# Altium schematic sheet Peripherals.SchDoc
size A4; SheetNumber: 3; SheetTotal: 3
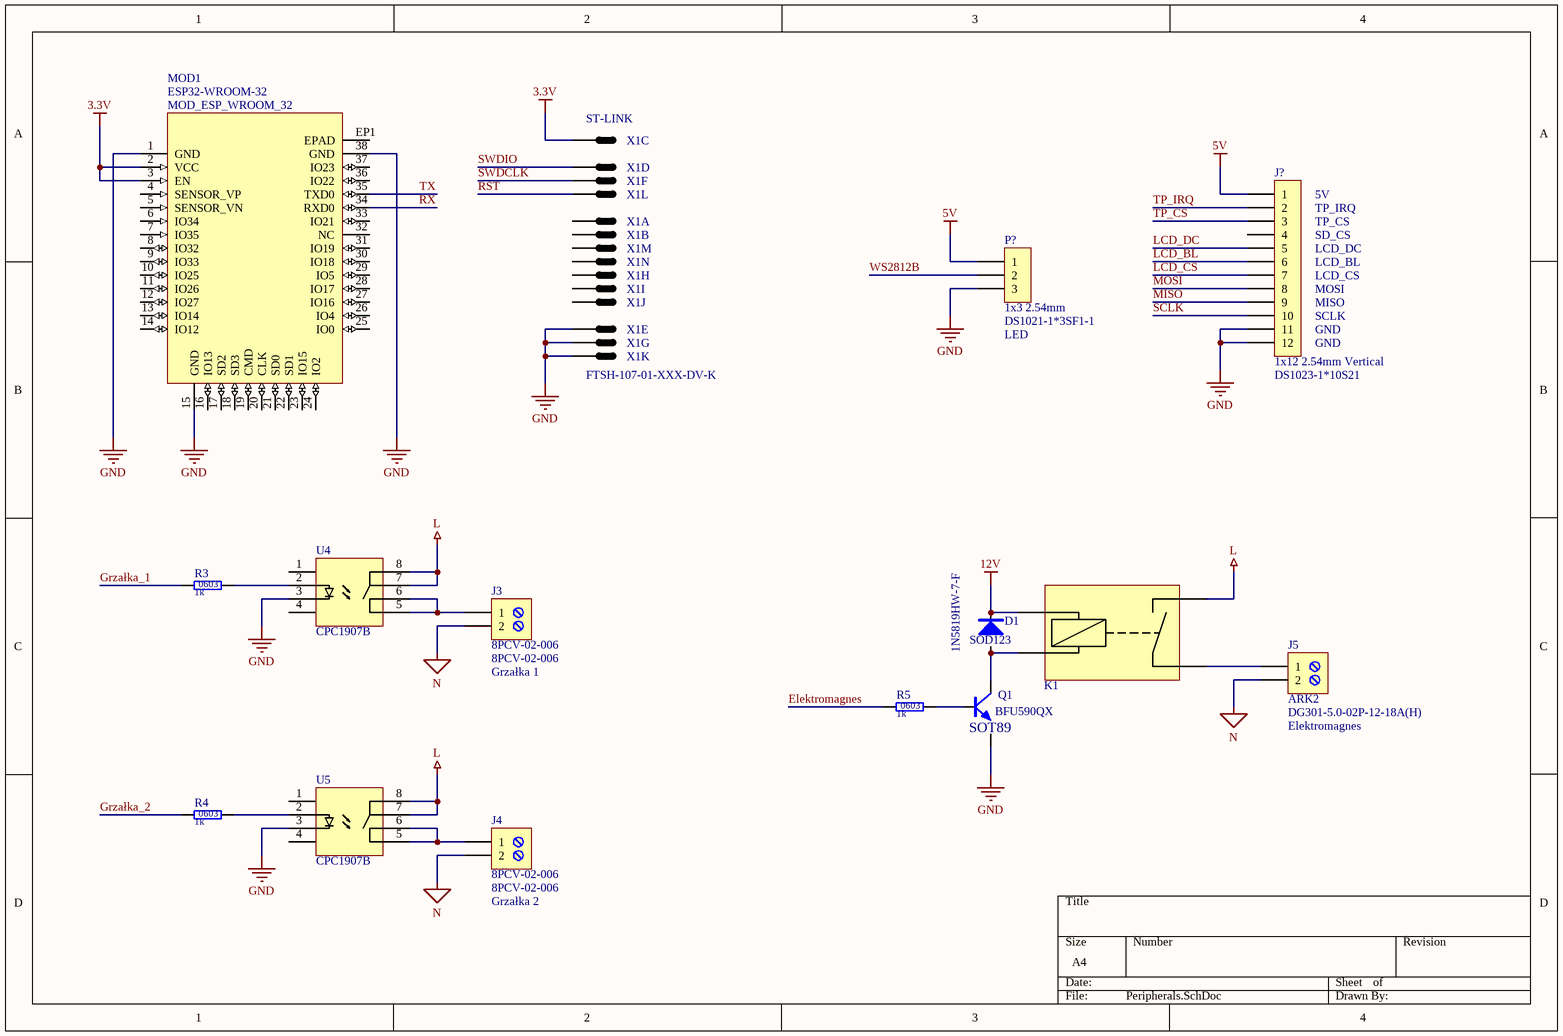
[diagram p0: Peripherals.SchDoc]

## Parts
D1  value 1N5819HW-7-F  [SOD123]  (hidden comment: 1N5819HW)
J3  value 8PCV-02-006  [J_8PCV-02-006]  (hidden comment: 600V 30A connector)
J4  value 8PCV-02-006  [J_8PCV-02-006]  (hidden comment: 600V 30A connector)
J5  value DG301-5.0-02P-12-18A(H)  [J_ARK2]  (hidden comment: ARK2)
J?  value DS1023-1*10S21  SCH_Footprint: 1x12 2.54mm Vertical  [J_HEADER_1x12_2.54_VERTICAL]  (hidden comment: Goldpin female straight)
K1  FTR-F3AA012E  [FTR-F3AA012E]  (value not drawn)
MOD1  value ESP32-WROOM-32  [MOD_ESP_WROOM_32]  (hidden comment: 2.4 GHz Wi-Fi-and-Bluetooth combo chip)
P?  value DS1021-1*3SF1-1  SCH_Footprint: 1x3 2.54mm  [P_HEADER_1x3_2.54]  (hidden comment: Goldpin)
Q1  SCH_Footprint: SOT89  [SOT89_TO-243AA_N]  (hidden comment: BFU590QX)
R3  value 1k  SCH_Footprint: 0603  [R_0603_1608]  (hidden comment: Resistor)
R4  value 1k  SCH_Footprint: 0603  [R_0603_1608]  (hidden comment: Resistor)
R5  value 1k  SCH_Footprint: 0603  [R_0603_1608]  (hidden comment: Resistor)
U4  CPC1907B  [CPC1907B]
U5  CPC1907B  [CPC1907B]
X1  FTSH-107-01-XXX-DV-K  [FTSH-107-01-XXX-DV-K]  (value not drawn)  (parts A,B,C,D,E,F,G,H,I,J,K,L,M,N of 14)

## Nets
3.3V: MOD1.2(VCC) MOD1.3(EN) X1.3
5V: J?.1 P?.1
12V: D1.1 K1.1
GND: J?.11 J?.12 MOD1.1(GND) MOD1.15(GND) MOD1.38(GND) P?.3 Q1.1(E) U4.3 U5.3 X1.5 X1.7 X1.11
L: K1.3 U4.7 U4.8 U5.7 U5.8
N: J3.2 J4.2 J5.2
Elektromagnes: R5.1
Grzałka_1: R3.1
Grzałka_2: R4.1
LCD_BL: J?.6
LCD_CS: J?.7
LCD_DC: J?.5
MISO: J?.9
MOSI: J?.8
RST: X1.12
RX: MOD1.34(RXD0)
SCLK: J?.10
SWDCLK: X1.6
SWDIO: X1.4
TP_CS: J?.3
TP_IRQ: J?.2
TX: MOD1.35(TXD0)
WS2812B: P?.2
NetD1_2: D1.2 K1.2 Q1.2(C)
NetJ3_1: J3.1 U4.5 U4.6
NetJ4_1: J4.1 U5.5 U5.6
NetJ5_1: J5.1 K1.4
NetQ1_3: Q1.3(B) R5.2
NetR3_2: R3.2 U4.2
NetR4_2: R4.2 U5.2

Not connected (* = marked no-connect by the designer): J? 4; MOD1 4(SENSOR_VP) 5(SENSOR_VN) 6(IO34) 7(IO35) 8(IO32) 9(IO33) 10(IO25) 11(IO26) 12(IO27) 13(IO14) 14(IO12) 16(IO13) 17(SD2) 18(SD3) 19(CMD) 20(CLK) 21(SD0) 22(SD1) 23(IO15) 24(IO2) 25(IO0) 26(IO4) 27(IO16) 28(IO17) 29(IO5) 30(IO18) 31(IO19) 32(NC) 33(IO21) 36(IO22) 37(IO23) EP1(EPAD); U4 1 4; U5 1 4; X1 1 2 8 9 10 13 14

## Notes on the sheet
- (near X1) ST-LINK
- (near J?) 5V
- (near J?) TP_IRQ
- (near J?) TP_CS
- (near J?) SD_CS
- (near J?) LCD_DC
- (near J?) LCD_BL
- (near J?) LCD_CS
- (near J?) MOSI
- (near J?) MISO
- (near J?) SCLK
- (near P?) LED
- (near J?) GND
- (near J3) Grzałka 1
- (near J5) Elektromagnes
- (near J4) Grzałka 2

## Library data of the parts
D1 = D_1N5819HW_1A_40V_SOD123: Manufacturer: Diodes Inc; Voltage: 40V; Current: 1A; SCH_Footprint: SOD123; Part Number: D_1N5819HW_1A_40V_SOD123; HelpURL: https://datasheet.octopart.com/1N5819HW-7-F-Diodes-Inc.-datasheet-8332965.pdf; Manufacturer Part Number: 1N5819HW-7-F; Supplier 1: TME; Supplier Part Number 1: 1N5819HW-7-F; Supplier 2: RS Components; Supplier Part Number 2: 7082197; Supplier 3: Farnell; Supplier Part Number 3: 1773475; Supplier 4: Mouser; Supplier Part Number 4: 621-1N5819HW-F; Supplier 5: Digi-Key; Supplier Part Number 5: 1N5819HW-FDICT-ND; Supplier 6: LCSC
J3 J4 = J_8PCV-02-006: ARK Screw terminal, 2-Pin; Manufacturer: TE Connectivity; SCH_Footprint: 8PCV-02-006; Part Number: J_8PCV-02-006; HelpURL: http://www.mouser.com/ds/2/418/NG_CD_6-1437657-3_K4-669783.pdf; Manufacturer Part Number: 8PCV-02-006; Supplier 1: TME; Supplier 2: RS Components; Supplier Part Number 2: 7176637; Supplier 3: Farnell; Supplier 4: Mouser; Supplier Part Number 4: 571-514376577; Supplier 5: Digi-Key; Supplier Part Number 5: A98460-ND; Supplier 6: LCSC
J5 = J_TB-5.0-P-2P: ARK Screw terminal, 2-Pin; Manufacturer: DEGSON ELECTRONICS; SCH_Footprint: ARK2; Part Number: J_TB-5.0-P-2P; HelpURL: https://datasheet.octopart.com/DG301-5.0-03P-12-18A%28H%29-Degson-datasheet-17801202.pdf; Manufacturer Part Number: DG301-5.0-02P-12-18A(H); Supplier 1: TME; Supplier Part Number 1: DG301-5.0-2/6B; Supplier 2: RS Components; Supplier 3: Farnell; Supplier 4: Mouser; Supplier 5: Digi-Key; Supplier 6: LCSC
J? = J_HEADER_1x12_2.54_VERTICAL: Pin Header; Manufacturer: Connfly; Part Number: J_HEADER_1x12_2.54_VERTICAL; HelpURL: https://www.tme.eu/Document/efd0203e2d3a140765df98191085ea88/DS1023.pdf; Manufacturer Part Number: DS1023-1*10S21; Supplier 1: TME; Supplier Part Number 1: ZL262-10SG; Supplier 2: RS Components; Supplier 3: Farnell; Supplier 4: Mouser; Supplier 5: Digi-Key; Supplier 6: LCSC
MOD1 = MOD_ESP32-WROOM-32: Manufacturer: ESPRESSIF; SCH_Footprint: MOD_ESP_WROOM_32; Part Number: MOD_ESP32-WROOM-32; HelpURL: https://www.espressif.com/sites/default/files/documentation/esp32-wroom-32d_esp32-wroom-32u_datasheet_en.pdf; Manufacturer Part Number: ESP32-WROOM-32; Supplier 1: TME; Supplier Part Number 1: ESP32-WROOM-32; Supplier 2: RS Components; Supplier Part Number 2: 169-7594; Supplier 3: Farnell; Supplier 4: Mouser; Supplier Part Number 4: 356-ESP-WROOM-32; Supplier 5: Digi-Key; Supplier Part Number 5: 1904-1010-1-ND; Supplier 6: LCSC
P? = P_HEADER_1x3_2.54: Pin Header; Manufacturer: Connfly; Part Number: P_HEADER_1x3_2.54; HelpURL: http://www.tme.eu/en/Document/cc301e58a5da78cb543a94b5a5b7f06a/DS1021.pdf; Manufacturer Part Number: DS1021-1*3SF1-1; Supplier 1: TME; Supplier Part Number 1: ZL201-03G; Supplier 2: RS Components; Supplier 3: Farnell; Supplier 4: Mouser; Supplier 5: Digi-Key; Supplier 6: LCSC
Q1 = QNP_BFU590QX: Manufacturer: NXP; Type: NPN; Voltage: 12V; Current: 200mA; Part Number: QNP_BFU590QX; Value: BFU590QX; HelpURL: https://www.nxp.com/docs/en/data-sheet/BFU590Q.pdf; Manufacturer Part Number: BFU590QX; Supplier 1: TME; Supplier 2: RS Components; Supplier 3: Farnell; Supplier Part Number 3: 2776273; Supplier 4: Mouser; Supplier Part Number 4: 771-BFU590QX; Supplier 5: Digi-Key; Supplier Part Number 5: 568-11522-1-ND; Supplier 6: LCSC
R3-R5 = R_1k_0603_1: Manufacturer: Vishay; Manufacturer Part Number: CRCW06031K00FKEA; Voltage: 75V; Power: 100mW; Tolerance: 1%; Part Number: R_1k_0603_1; HelpURL: http://www.farnell.com/datasheets/2310790.pdf?_ga=2.256888843.1690599162.1548417389-1379097396.1542296996&_gac=1.262631934.1547230258.Cj0KCQiAmuHhBRD0ARIsAFWyPwhX8HcvXnM3tA0ZBodZLzDIjH2ZxLpjT5LWo9bad_HPRbU8LfPq44UaAhEwEALw_wcB; Supplier 1: TME; Supplier 2: RS Components; Supplier Part Number 2: 678-9875P; Supplier 3: Farnell; Supplier Part Number 3: 1469740; Supplier 4: Mouser; Supplier Part Number 4: 71-CRCW0603-1.0K-E3; Supplier 5: Digi-Key; Supplier Part Number 5: 541-1.00KHCT-ND; Supplier 6: LCSC
X1 = FTSH-107-01-XXX-DV-K: IDC 14pin male connector